# EAGLE design ZorkShieldUNO (EAGLE 7.3.0)
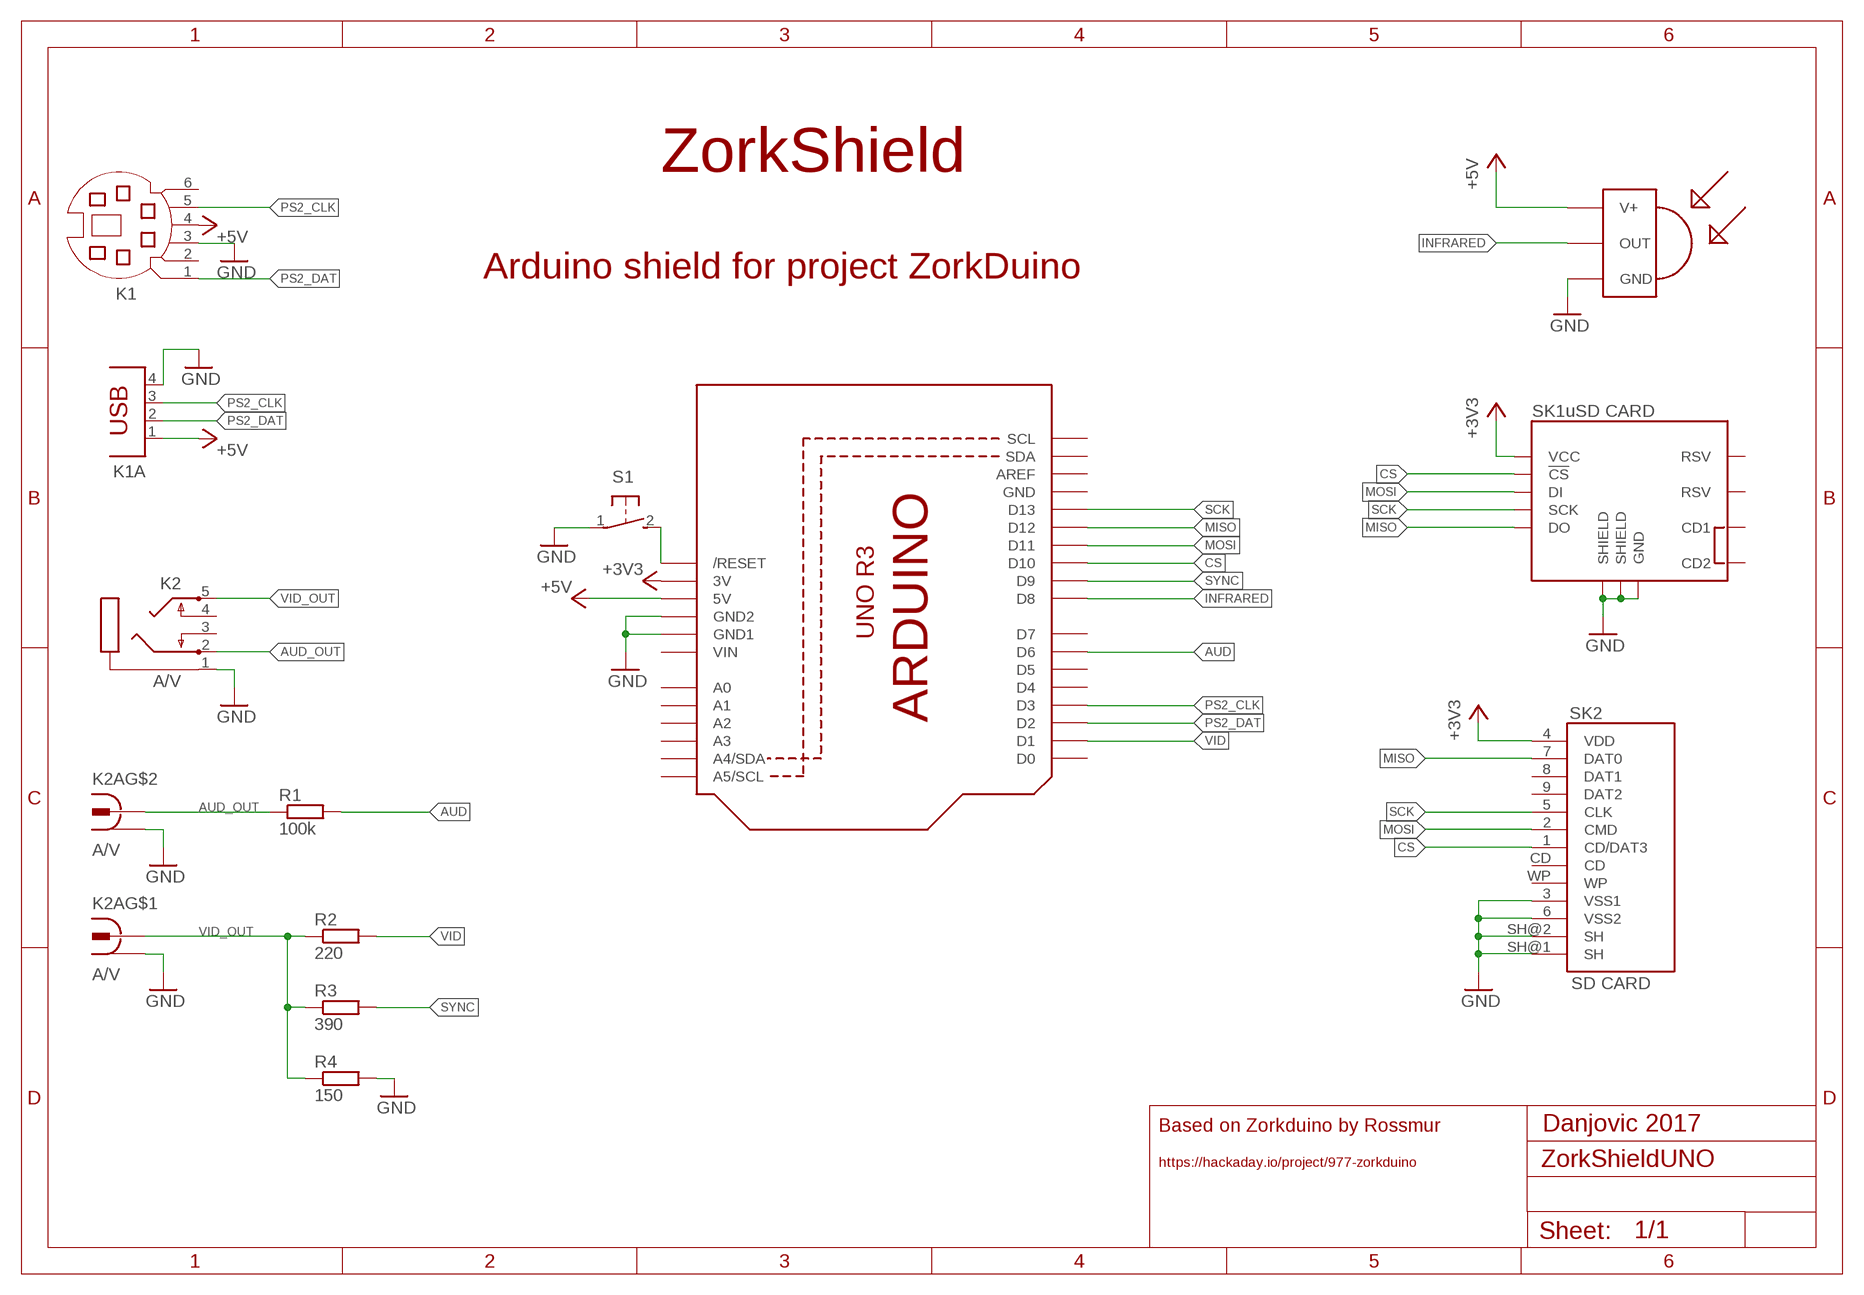
[diagram p0: schematic, sheet 1]

## Parts
IR1  TSOP4837  [TSOP18XX]
K1  MD06SS  [MDIN06SS]
K1A  PN87520  [PN87520]
K2  A/V  PG203J  [PG203J]
K2A  A/V  DOUBLE_VERTICALMOD2  [DOUBLE_VERTICAL_2]
Q1  ARDUINOR3-NOIOREF-NOTEXT  [ARDUINOR3-NOTEXT-NOIOREF]
R1  100k  R-EU_0204/7  [0204/7]
R2  220  R-EU_0204/7  [0204/7]
R3  390  R-EU_0204/7  [0204/7]
R4  150  R-EU_0204/7  [0204/7]
S1  31-XX  [B3F-31XX]
SK1  uSD CARD  USD_CONNECTOR  [MICRO-SD-SOCKET-PP]
SK2  SD CARD  SD_CARD_SOCKET4UCON  [SDCARD_4UCONN]

## Nets
+3V3: Q1.3V SK1.VCC SK2.4(VDD)
+5V: IR1.VCC(V+) K1.4 K1A.1 Q1.5V
AUD: Q1.D6 R1.2
AUD_OUT: K2.2 K2A.LS R1.1
CS: Q1.D10 SK1.CS(!CS) SK2.1(CD/DAT3)
GND: IR1.GND K1.3 K1A.4 K2.1 K2A.HG K2A.LG Q1.GND1 Q1.GND2 R4.2 S1.1(P) SK1.GND SK1.GND1(SHIELD) SK1.GND3(SHIELD) SK2.3(VSS1) SK2.6(VSS2) SK2.SH@1(SH) SK2.SH@2(SH)
INFRARED: IR1.OUT Q1.D8
MISO: Q1.D12 SK1.DO SK2.7(DAT0)
MOSI: Q1.D11 SK1.DI SK2.2(CMD)
N$11: Q1.RESET(/RESET) S1.2(S)
PS2_CLK: K1.5 K1A.3 Q1.D3
PS2_DAT: K1.1 K1A.2 Q1.D2
SCK: Q1.D13 SK1.SCLK(SCK) SK2.5(CLK)
SYNC: Q1.D9 R3.2
VID: Q1.D1 R2.2
VID_OUT: K2.5 K2A.HS R2.1 R3.1 R4.1
Unconnected: K1.2 K1.6 K2.3 K2.4 Q1.A0 Q1.A1 Q1.A2 Q1.A3 Q1.A4(A4/SDA) Q1.A5(A5/SCL) Q1.AREF Q1.D0 Q1.D4 Q1.D5 Q1.D7 Q1.SCL Q1.SDA SK1.CD1 SK1.CD2 SK1.RSV1(RSV) SK1.RSV2(RSV) SK2.8(DAT1) SK2.9(DAT2) SK2.CD SK2.WP

## Notes on the sheet
- ZorkShield
- Arduino shield for project ZorkDuino
- Based on Zorkduino by Rossmur | Danjovic 2017
- https://hackaday.io/project/977-zorkduino

## Power pins joined to a net without a drawn wire
GND: Q1.GND
VIN: Q1.VIN

## Library data of the parts
IR1 = tsop:TSOP4837: IR Receiver and Demodulator
K1 = con-yamaichi:MD06SS: YAMAICHI CONNECTOR; OC_FARNELL: unknown; OC_NEWARK: unknown
K1A = con-berg:PN87520: BERG USB connector; OC_FARNELL: unknown; OC_NEWARK: unknown
K2 = con-hirschmann:PG203J: MIC/HEADPHONE JACK KS-S stereo microphone/headphone jack PG203JN (Schukat); OC_FARNELL: unknown; OC_NEWARK: unknown
K2A = con-rca-board:DOUBLE_VERTICAL
Q1 = adafruit:ARDUINOR3-NOIOREF
R1-R4 = rcl:R-EU_: RESISTOR, European symbol
S1 = switch-omron:31-XX: OMRON SWITCH; MPN: B3F-3100; OC_FARNELL: 959704; OC_NEWARK: 36M3582
SK1 = SparkFun-Connectors:USD_CONNECTOR: microSD Socket Push-push type µSD socket. Footprint production proven. Symbol has new and improved layout and naming accuracy. SparkFun Electronics SKU : PRT-00127. tDoc lines correctly indicate media card edge positions when inserting (unlocked, locked, depressed). NOTE: CD1 and CD2 are connected internally; PROD_ID: CONN-07820
SK2 = SparkFun-Connectors:SD_CARD_SOCKET: SD Memory Card Connector, push-push normal type, CD enable, WP enable

## Board
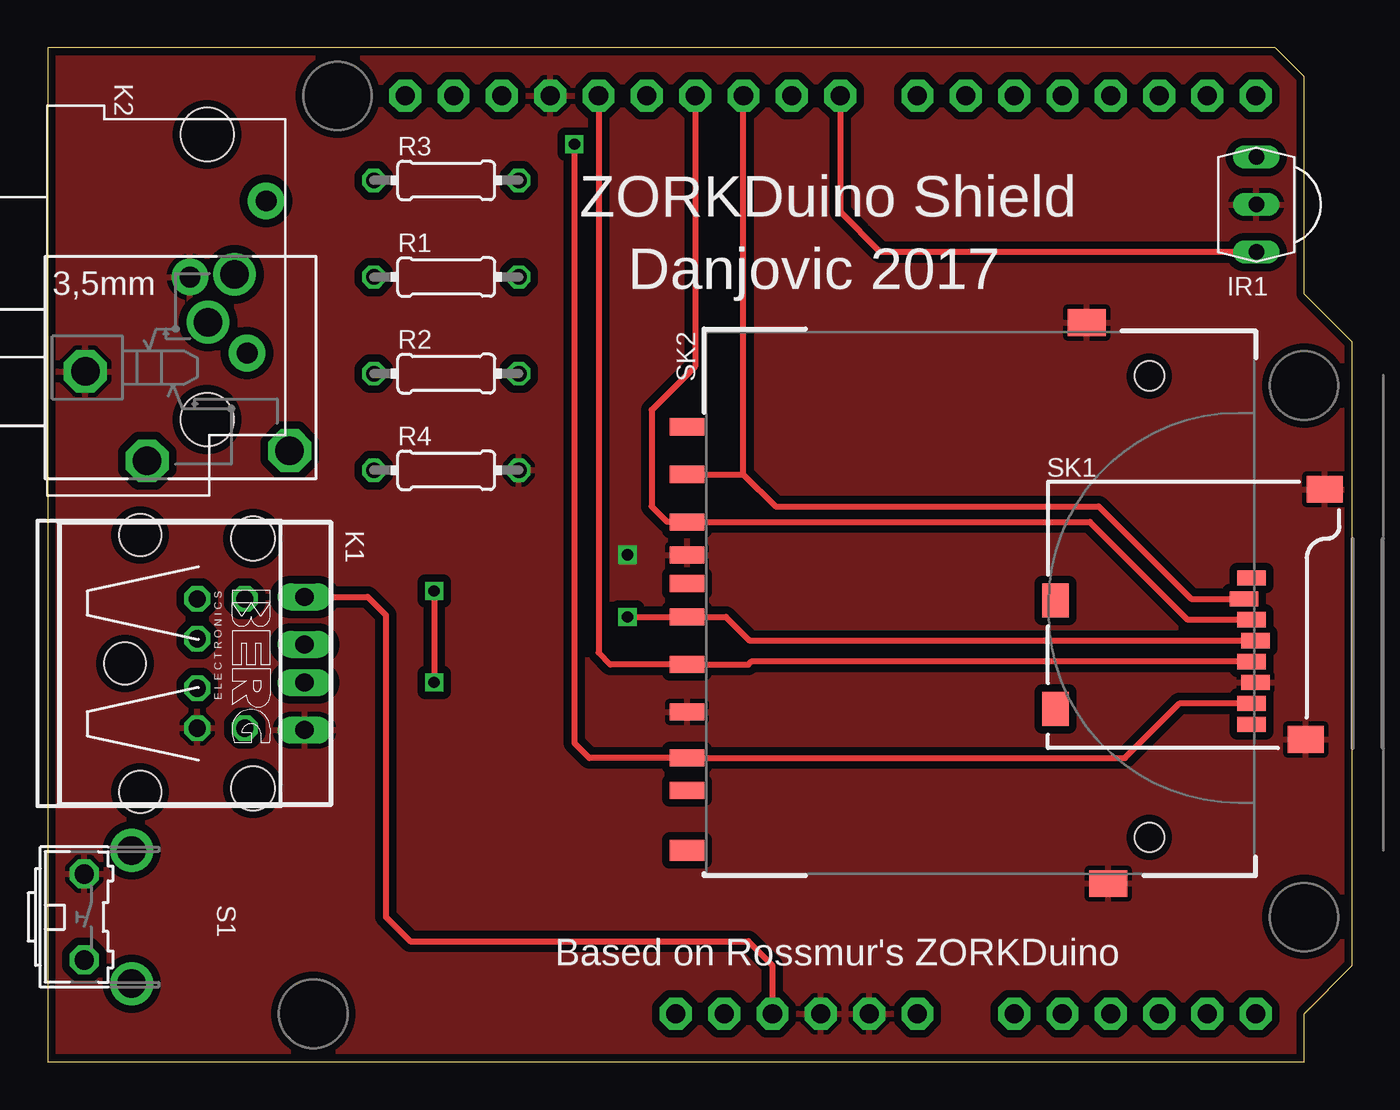
[diagram p1: board, top side]
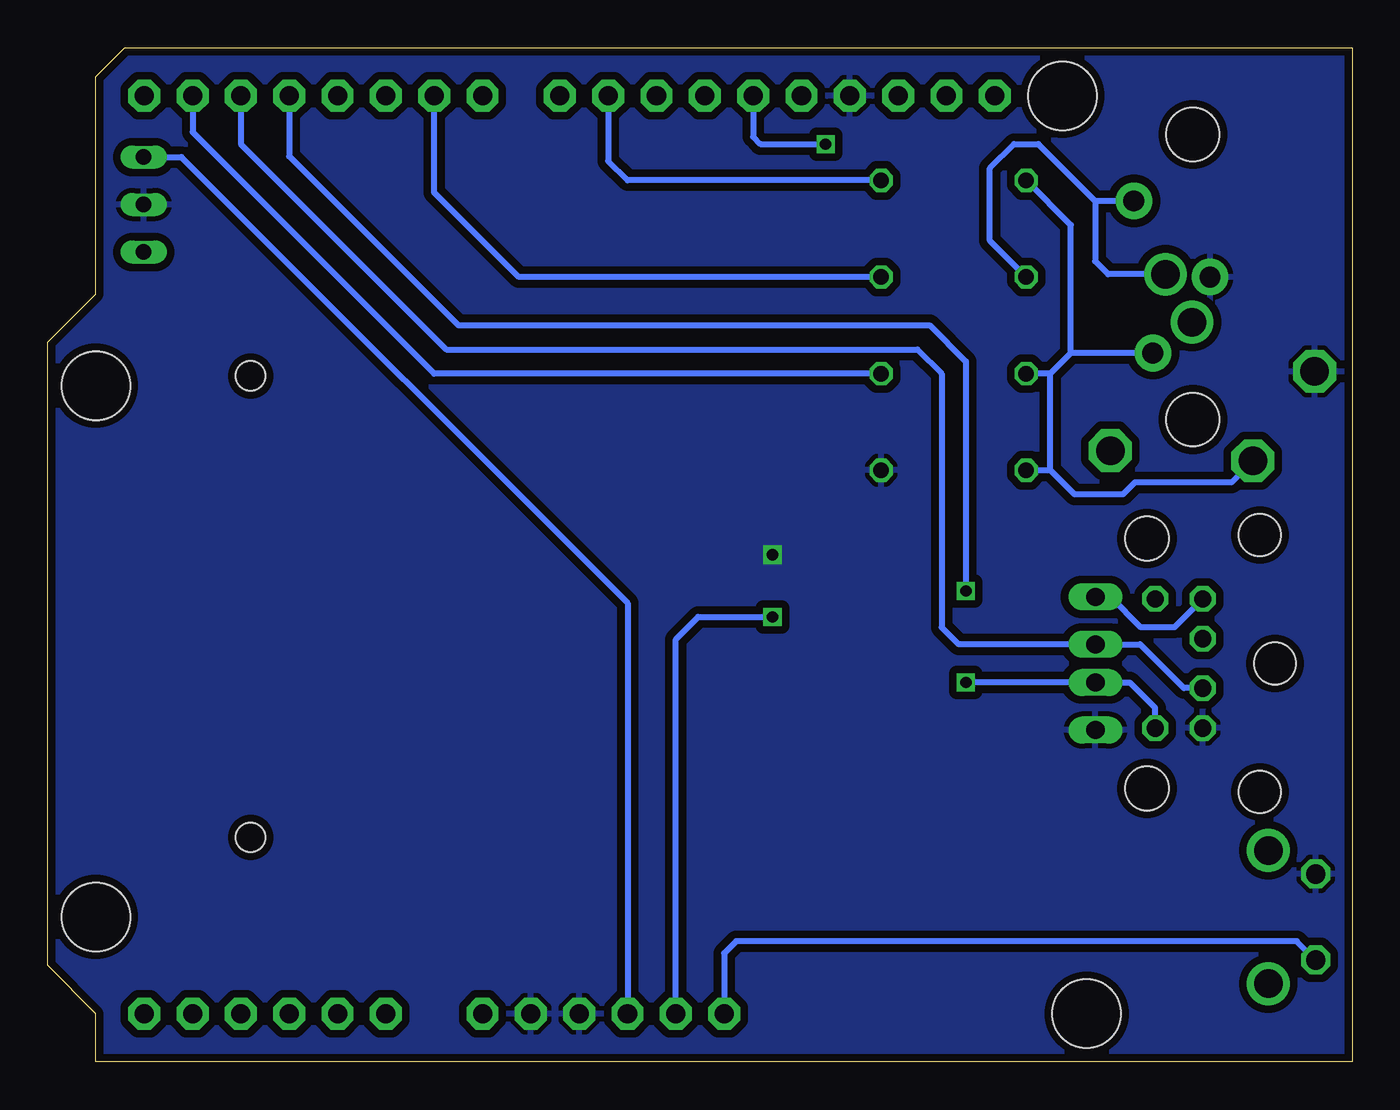
[diagram p2: board, bottom side, seen from below]

Size 68.58 x 53.34 mm. Coordinates in mm from the lower left corner, seen from the top.
Copper layers (1*16): Top 0.0356mm / dielectric 1.5011mm / Bottom 0.0356mm
Design rules "oshpark-2layer": minimum track width 6mil, minimum drill 13mil, track to track 6mil, track to pad 6mil, pad to pad 6mil, via to via 6mil, smd to smd 6mil, copper to edge 15mil, drill to drill 6mil, minimum pad ring 7mil, minimum via ring 7mil, stop-mask expansion 2.5mil, vias tented up to drill 0mil, thermal gap 10mil
Holes 3.6 mm at 13.97,2.54 15.24,50.8 66.04,7.62 66.04,35.56

### Footprints (pad centres in the part's own frame; a part is rotated, then mirrored left to right if it is on the bottom)
TSOP18XX = drill 0.813 long: GND -0.001,-0.027; OUT -2.501,-0.027; VCC 2.499,-0.027
MDIN06SS = drill 0.9 octagon: 1 1.3,8.5; 2 -1.3,8.5; 3 3.4,8.5; 4 -3.4,8.5; 5 3.4,11; 6 -3.4,11 | hole 2.2: -6.75,5.5; 0,4.7; 6.75,5.5
PN87520 = drill 0.95 long: 1 -3.5,2.71; 2 -1,2.71; 3 1,2.71; 4 3.5,2.71 | hole 2.3: -6.57,0; 6.57,0
PG203J = drill 1.499 octagon: 1 -5.004,-0.203; 4 5.74,-4.369; 5 -1.753,-4.902 | drill 1.499: 2 2.845,4.902; 3 1.448,2.388
DOUBLE_VERTICAL_2 = drill 1.1 pad 1.93: HG 0,-0.5; HS -4,-3.5; LG 0,-0.5; LS 4,-4.5 | hole 2.8: 7.5,-1.4; -7.5,-1.4
ARDUINOR3-NOTEXT-NOIOREF = drill 1 pad 1.676 octagon: 3V 35.56,2.54; 5V 38.1,2.54; A0 50.8,2.54; A1 53.34,2.54; A2 55.88,2.54; A3 58.42,2.54; A4 60.96,2.54; A5 63.5,2.54; AREF 23.876,50.8; D0 63.5,50.8; D1 60.96,50.8; D2 58.42,50.8; D3 55.88,50.8; D4 53.34,50.8; D5 50.8,50.8; D6 48.26,50.8; D7 45.72,50.8; D8 41.656,50.8; D9 39.116,50.8; D10 36.576,50.8; D11 34.036,50.8; D12 31.496,50.8; D13 28.956,50.8; GND 26.416,50.8; GND1 43.18,2.54; GND2 40.64,2.54; RESET 33.02,2.54; SCL 18.796,50.8; SDA 21.336,50.8; VIN 45.72,2.54
0204/7 = drill 0.813 octagon: 1 -3.81,0; 2 3.81,0
B3F-31XX = drill 1.016 octagon: 1 -2.261,-1.245; 2 2.261,-1.245 | drill 1.499 pad 2.159: 3 -3.505,1.245; 4 3.505,1.245
MICRO-SD-SOCKET-PP = smd 1.8 x 1.4: CD1 -2.05,0.4; CD2 -7.75,0.4 | smd 0.8 x 1.5: CS -7.84,10.3; DI -6.74,10.7; DO -2.34,10.7; GND -3.44,10.9; RSV1 -8.94,10.7; RSV2 -1.24,10.7; SCLK -4.54,10.7; VCC -5.64,10.9 | smd 1.4 x 1.9: GND1 -13.6,14.55; GND3 -0.45,13.55
SDCARD_4UCONN = smd 1.8 x 0.9: 1 -1,6.77; 2 -1,4.27; 3 -1,2.52; 4 -1,-0.73; 5 -1,-3.23; 6 -1,-5.73; 7 -1,-8.15; 8 -1,-9.85; 9 -1,9.27; CD -1,1.02 | smd 2 x 1.4: SH@1 20,14.75; SH@2 21.15,-14.75 | smd 1.8 x 1.1: WP -1,-13 | hole 1.55: 23.3,11.94; 23.3,-12.32

### Placement (x,y rotation side)
IR1  63.5,45.09 90 top
K1  -0.64,20.95 270 top
K1A  10.79,20.95 270 top
K2  6.99,36.51 0 top
K2A  6.99,41.27 90 top
Q1  0,0 0 top
R1  20.95,41.27 0 top
R2  20.95,36.2 0 top
R3  20.95,46.35 0 top
R4  20.95,31.11 0 top
S1  3.17,7.62 270 top
SK1  52.58,16.51 270 top
SK2  34.61,24.13 0 top

### Tracks (layer width: path | path; a pad name or v marks a point on that pad's centre or on a via)
+3V3  (via drill 0.6)
  Top 0.305: SK1.VCC 36.91,22.15 35.66,23.4 SK2.4 v30.48,23.4
  Bottom 0.305: Q1.3V 35.56,22.23 34.38,23.4 v30.48,23.4
+5V
  Top 0.305: K1A.1 16.82,24.45 17.78,23.5 17.78,7.62 19.05,6.35 36.83,6.35 38.1,5.08 Q1.5V
  Bottom 0.305: K1.4 9.36,22.86 11.11,22.86 12.71,24.45 K1A.1 | IR1.VCC 61.55,47.58 38.1,24.13 Q1.5V
AUD
  Bottom 0.305: R1.2 43.81,41.27 48.26,45.72 Q1.D6
AUD_OUT
  Bottom 0.305: R1.1 19.05,43.18 19.05,46.99 17.78,48.26 16.51,48.26 13.53,45.27 | K2A.LS 13.53,45.27 | K2.2 12.84,41.41 13.53,42.1 13.53,45.27
CS
  Top 0.305: SK2.1 36.58,30.9 | 36.58,30.9 Q1.D10 | 36.58,30.9 38.27,29.21 55.24,29.21 60.1,24.35 SK1.CS
GND  (via drill 0.6)
  other vias: 30.48,26.67
  pour Top (isolate 0.406): 0,53.34 0,0 68.58,0 68.58,53.34
  pour Bottom (isolate 0.406): 0,53.34 0,0 68.58,0 68.58,53.34
INFRARED
  Top 0.305: IR1.OUT 43.78,42.58 41.66,44.7 Q1.D8
MISO  (via drill 0.6)
  Top 0.305: SK1.DO 59.49,18.85 56.62,15.98 SK2.7 28.47,15.98 27.69,16.76 v27.69,48.26
  Bottom 0.305: Q1.D12 31.5,48.64 31.11,48.26 v27.69,48.26
MOSI
  Top 0.305: Q1.D11 34.04,36.58 31.75,34.29 31.75,29.21 32.56,28.4 SK2.2 54.78,28.4 59.94,23.25 SK1.DI
N$11
  Bottom 0.305: S1.2 2.92,6.35 32.38,6.35 33.02,5.71 Q1.RESET
PS2_CLK  (via drill 0.6)
  Top 0.305: v20.32,24.77 v20.32,19.95
  Bottom 0.305: K1.5 10.37,18.62 11.7,19.95 K1A.3 v20.32,19.95 | v20.32,24.77 20.32,36.83 22.23,38.73 46.99,38.73 55.88,47.62 Q1.D3
PS2_DAT
  Bottom 0.305: K1.1 8.86,19.66 11.16,21.95 K1A.2 20.68,21.95 21.59,22.86 21.59,36.2 22.86,37.47 47.62,37.47 58.42,48.26 Q1.D2
SCK
  Top 0.305: SK1.SCLK 36.98,21.05 36.83,20.9 SK2.5 29.58,20.9 28.96,21.53 Q1.D13
SYNC
  Bottom 0.305: Q1.D9 39.12,47.37 38.1,46.35 R3.2
VID
  Bottom 0.305: Q1.D1 60.96,48.9 48.26,36.2 R2.2
VID_OUT
  Bottom 0.305: K2.5 5.23,31.6 6.35,30.48 11.43,30.48 12.06,29.84 14.61,29.84 15.88,31.11 | 15.88,31.11 15.88,36.2 | 15.88,36.2 R2.1 | K2A.HS 14.79,37.27 | 14.79,37.27 15.88,36.2 | 14.79,37.27 14.79,44.01 R3.1 | R4.1 15.88,31.11

### Text on the board
tPlace: ZORKDuino Shield | Danjovic 2017 | Based on Rossmur's ZORKDuino
tNames: IR1
tValues: TSSOP48 | KEYBOARD | RESET